# EAGLE schematic gamecontroller_Arduino_1.3 (EAGLE 9.3.0)
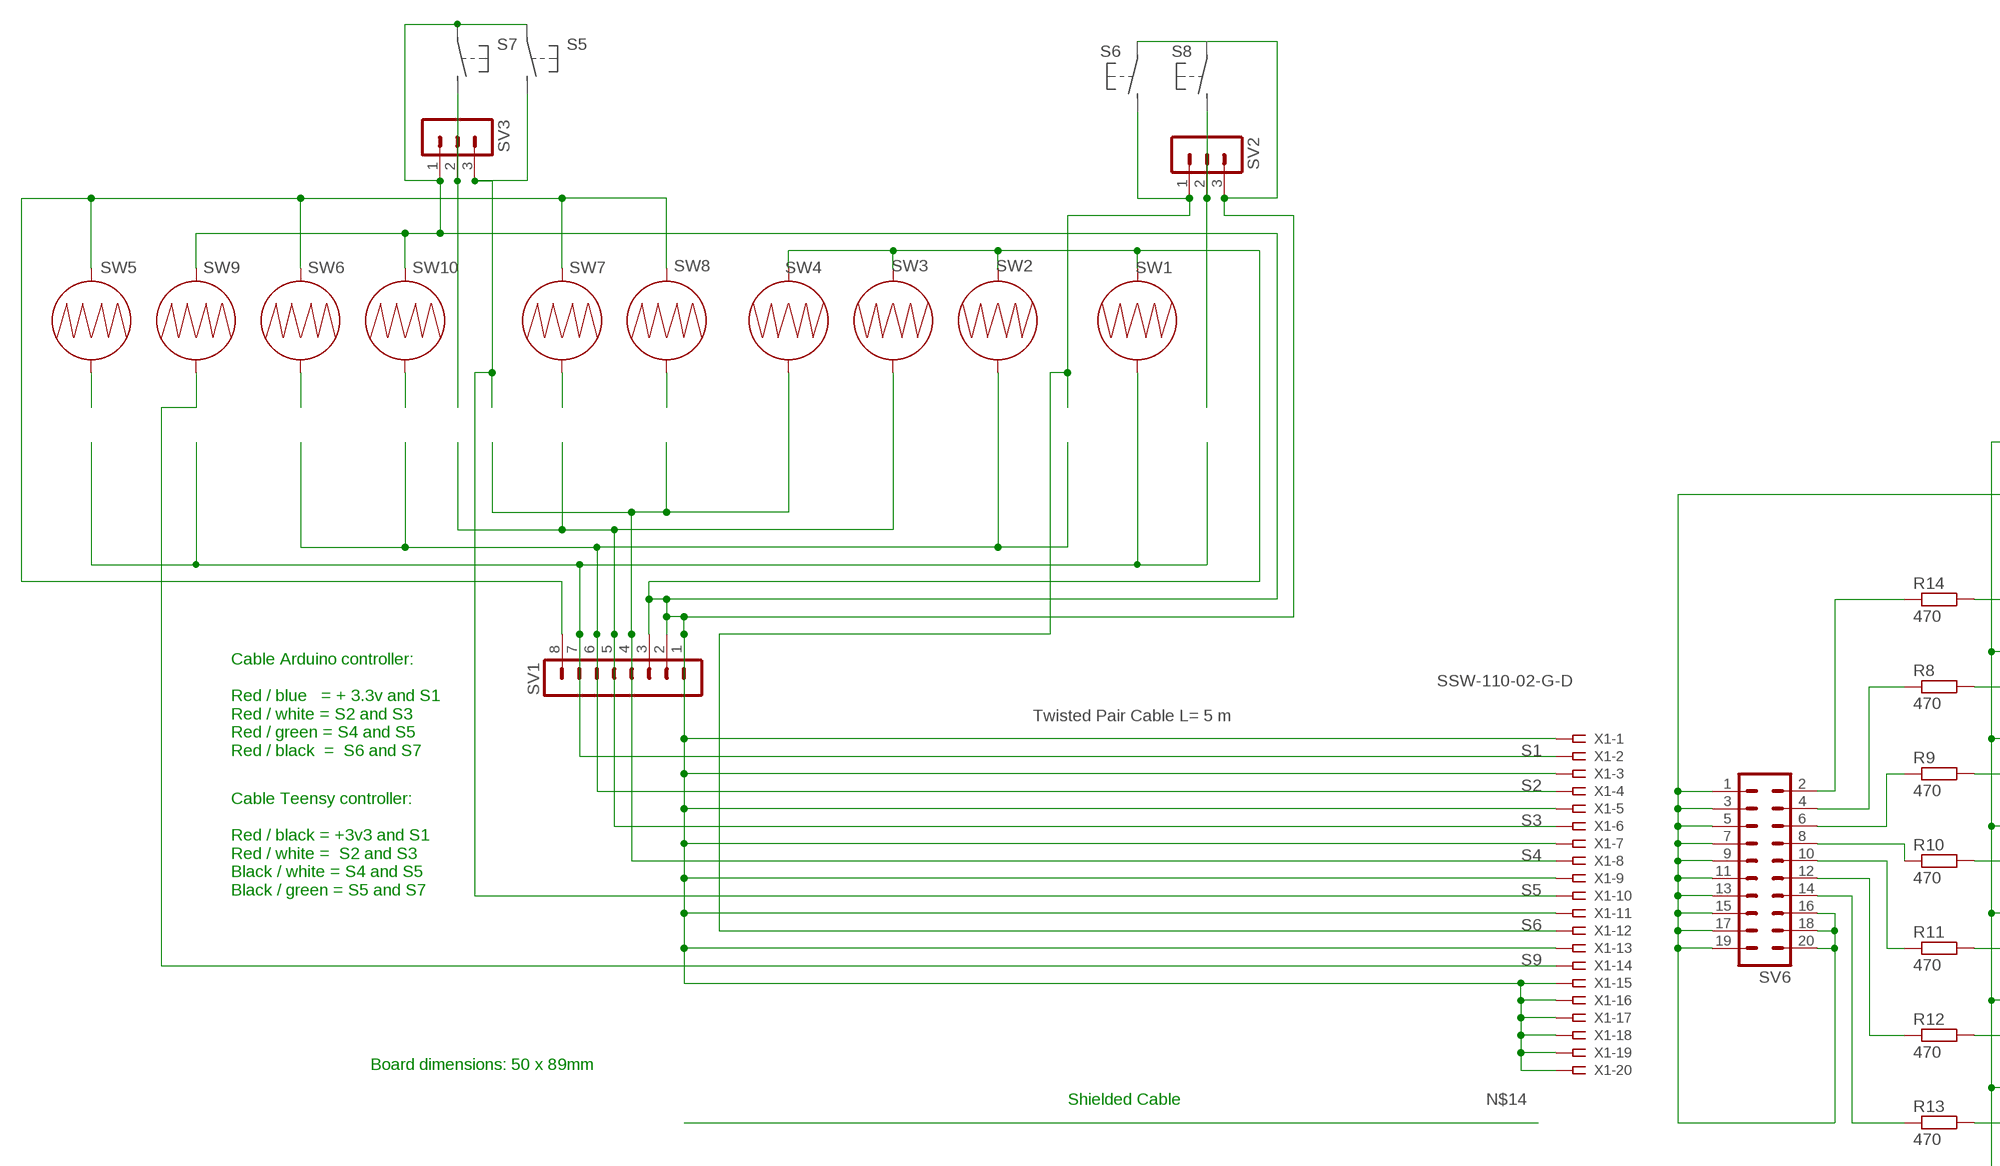
[diagram p0: schematic, sheet 1, part 1 of 2]
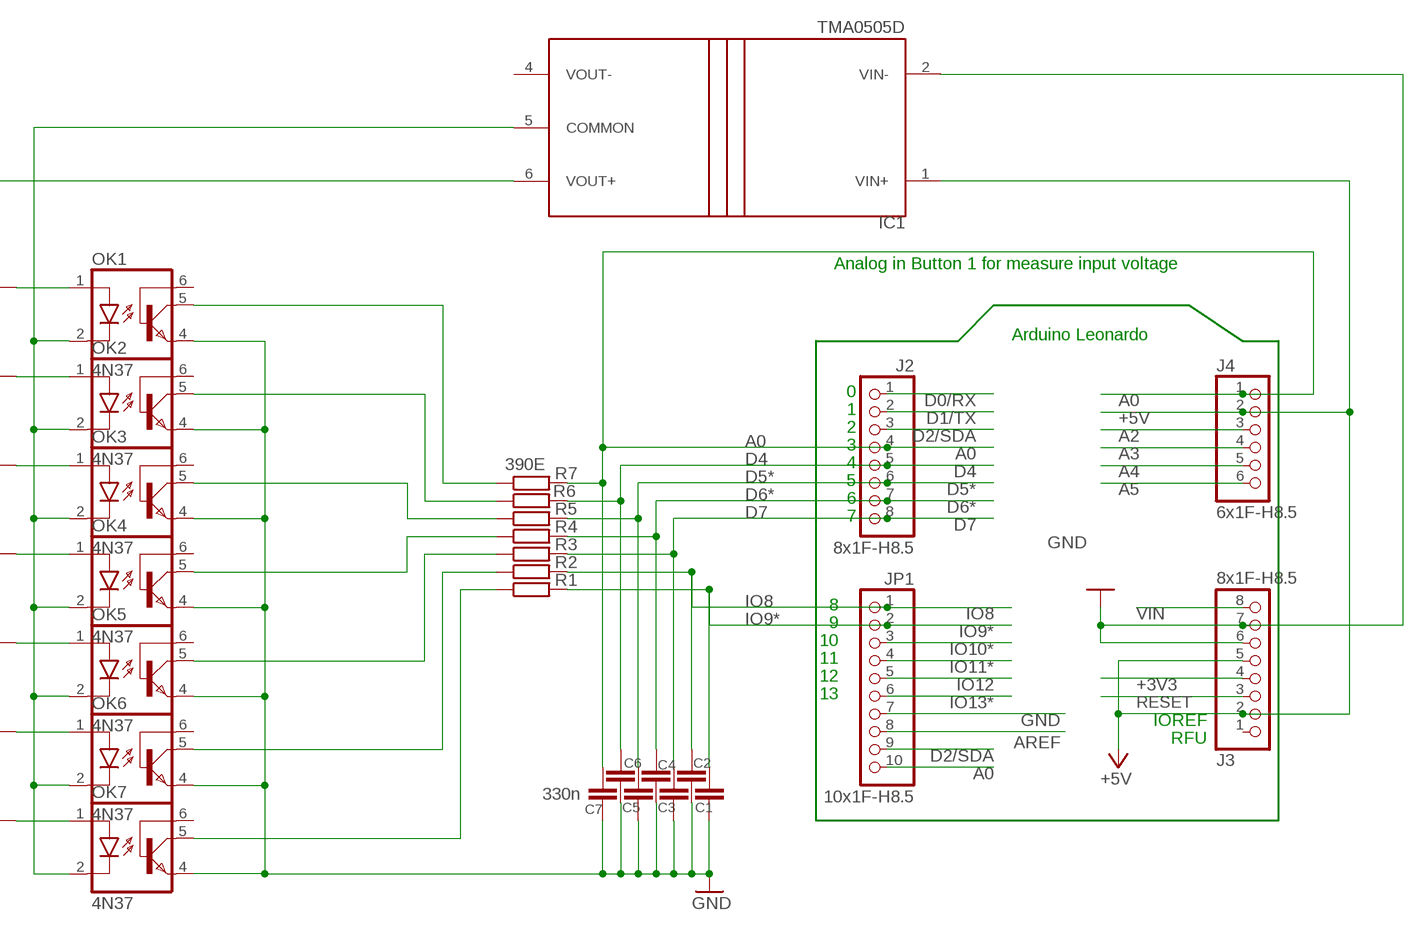
[diagram p1: schematic, sheet 1, part 2 of 2]

## Parts
C1  C-EU025-025X050  [C025-025X050]
C2  C-EU025-025X050  [C025-025X050]
C3  C-EU025-025X050  [C025-025X050]
C4  C-EU025-025X050  [C025-025X050]
C5  C-EU025-025X050  [C025-025X050]
C6  C-EU025-025X050  [C025-025X050]
C7  330n  C-EU025-025X050  [C025-025X050]
IC1  TMA0505D  [SIP7]
J2  8x1F-H8.5  PINHD-1X8  [1X08]
J3  8x1F-H8.5  PINHD-1X8  [1X08]
J4  6x1F-H8.5  PINHD-1X6  [1X06]
JP1  10x1F-H8.5  PINHD-1X10  [1X10]
OK1  4N37  [DIL06]
OK2  4N37  [DIL06]
OK3  4N37  [DIL06]
OK4  4N37  [DIL06]
OK5  4N37  [DIL06]
OK6  4N37  [DIL06]
OK7  4N37  [DIL06]
R1  R-EU_0204/5  [0204/5]
R2  R-EU_0204/5  [0204/5]
R3  R-EU_0204/5  [0204/5]
R4  R-EU_0204/5  [0204/5]
R5  R-EU_0204/5  [0204/5]
R6  R-EU_0204/5  [0204/5]
R7  390E  R-EU_0204/5  [0204/5]
R8  470  R-EU_0204/5  [0204/5]
R9  470  R-EU_0204/5  [0204/5]
R10  470  R-EU_0204/5  [0204/5]
R11  470  R-EU_0204/5  [0204/5]
R12  470  R-EU_0204/5  [0204/5]
R13  470  R-EU_0204/5  [0204/5]
R14  470  R-EU_0204/5  [0204/5]
SV1  MA08-1  [MA08-1]
SV2  MA03-1  [MA03-1]
SV3  MA03-1  [MA03-1]
SV6  MA10-2W  [MA10-2W]
SW1  BUTTON-CONDUCTIVESMD-0.1"  [BUTTON-CONDUCTIVE-0.1]
SW2  BUTTON-CONDUCTIVESMD-0.1"  [BUTTON-CONDUCTIVE-0.1]
SW3  BUTTON-CONDUCTIVESMD-0.1"  [BUTTON-CONDUCTIVE-0.1]
SW4  BUTTON-CONDUCTIVESMD-0.1"  [BUTTON-CONDUCTIVE-0.1]
SW5  BUTTON-CONDUCTIVESMD-0.1"  [BUTTON-CONDUCTIVE-0.1]
SW6  BUTTON-CONDUCTIVESMD-0.1"  [BUTTON-CONDUCTIVE-0.1]
SW7  BUTTON-CONDUCTIVESMD-0.1"  [BUTTON-CONDUCTIVE-0.1]
SW8  BUTTON-CONDUCTIVESMD-0.1"  [BUTTON-CONDUCTIVE-0.1]
SW9  BUTTON-CONDUCTIVESMD-0.1"  [BUTTON-CONDUCTIVE-0.1]
SW10  BUTTON-CONDUCTIVESMD-0.1"  [BUTTON-CONDUCTIVE-0.1]
X1  SSW-110-02-G-D  [SSW-110-02-G-D]

## Nets
+3V3: J3.4
+5V [usbvcc]: IC1.1(VIN+) J3.2 J3.5 J4.2
A0: C7.1 J2.4 J4.1 JP1.10 R7.2
A2: J4.3
A3: J4.4
A4: J4.5
A5: J4.6
AREF [aref]: JP1.8
COMMON: SV1.1 SV1.2 SV1.3 SV2.3 SV3.1 SW1.2 SW2.2 SW3.2 SW4.2 SW9.1 SW10.1 X1.1 X1.3 X1.5 X1.7 X1.9 X1.11 X1.13 X1.15 X1.16 X1.17 X1.18 X1.19 X1.20
D0/RX: J2.1
D1/TX: J2.2
D2/SDA: J2.3 JP1.9
D4: C6.1 J2.5 R6.2
D5*: C5.1 J2.6 R5.2
D6*: C4.1 J2.7 R4.2
D7: C3.1 J2.8 R3.2
GND: C1.2 C2.2 C3.2 C4.2 C5.2 C6.2 C7.2 IC1.2(VIN-) J3.6 J3.7 JP1.7 OK1.4(EMI) OK2.4(EMI) OK3.4(EMI) OK4.4(EMI) OK5.4(EMI) OK6.4(EMI) OK7.4(EMI)
IO8: C2.1 JP1.1 R2.2
IO9*: C1.1 JP1.2 R1.2
IO10*: JP1.3
IO11*: JP1.4
IO12: JP1.5
IO13*: JP1.6
N$1: R8.1 SV6.4
N$2: SV3.2
N$3: OK1.1(A) R14.2
N$4: SV1.8 SW5.1 SW6.1 SW7.1 SW8.1
N$5: SW10.2
N$6: R14.1 SV6.2
N$7: IC1.6(VOUT+) SV6.1 SV6.3 SV6.5 SV6.7 SV6.9 SV6.11 SV6.13 SV6.15 SV6.16 SV6.17 SV6.18 SV6.19 SV6.20
N$8: OK1.5(COL) R7.1
N$9: SW6.2
N$10: R9.1 SV6.6
N$11: SW8.2
N$12: SW5.2
N$13: R10.1 SV6.8
N$15: R11.1 SV6.10
N$16: SW7.2
N$17: R12.1 SV6.12
N$18: OK2.5(COL) R6.1
N$19: SV2.2
N$20: OK3.5(COL) R5.1
N$21: OK4.5(COL) R4.1
N$22: OK5.5(COL) R3.1
N$23: OK6.5(COL) R2.1
N$24: OK7.5(COL) R1.1
N$25: OK2.1(A) R8.2
N$26: OK3.1(A) R9.2
N$27: OK4.1(A) R10.2
N$29: R13.1 SV6.14
N$30: OK7.1(A) R13.2
N$31: OK6.1(A) R12.2
N$32: OK5.1(A) R11.2
N$35: IC1.5(COMMON) OK1.2(C) OK2.2(C) OK3.2(C) OK4.2(C) OK5.2(C) OK6.2(C) OK7.2(C)
RESET: J3.3
S1: SV1.7 SW1.1 X1.2
S2: SV1.6 SW2.1 X1.4
S3: SV1.5 SW3.1 X1.6
S4: SV1.4 SW4.1 X1.8
S5: SV3.3 X1.10
S6: SV2.1 X1.12
S9: SW9.2 X1.14
VIN [power]: J3.8
Unconnected: J3.1 OK1.6(BAS) OK2.6(BAS) OK3.6(BAS) OK4.6(BAS) OK5.6(BAS) OK6.6(BAS) OK7.6(BAS)

## Notes on the sheet
- Analog in Button 1 for measure input voltage
- Arduino Leonardo
- 0
- 1
- Twisted Pair Cable L= 5 m
- 2
- 3
- Cable Arduino controller:
  
  Red / blue   = + 3.3v and S1
  Red / white = S2 and S3
  Red / green = S4 and S5
  Red / black  =  S6 and S7
- 4
- 5
- 6
- 7
- Cable Teensy controller:
  
  Red / black = +3v3 and S1
  Red / white =  S2 and S3
  Black / white = S4 and S5
  Black / green = S5 and S7
- 8
- 9
- 10
- 11
- 12
- 13
- IOREF
- RFU
- Board dimensions: 50 x 89mm
- Shielded Cable

## Power pins joined to a net without a drawn wire
VOUT-: IC1.4(VOUT-)

## Library data of the parts
C1-C7 = rcl:C-EU: CAPACITOR, European symbol; SPICEPREFIX: C
IC1 = traco_tma:TMA: Traco Power TMA Series DC/DC Converter
J2 J3 = SmartPrj:PINHD-1X8: PIN HEADER
J4 = SmartPrj:PINHD-1X6: PIN HEADER
JP1 = SmartPrj:PINHD-1X10: PIN HEADER
OK1-OK7 = optocoupler:4N37: OPTO COUPLER Source: http://www.fairchildsemi.com/pf/4N/4N35-M.html; MF: FAIRCHILD SEMICONDUCTOR; MPN: 4N37; OC_FARNELL: 1612456; OC_NEWARK: 72K9948
R1-R14 = rcl:R-EU_: RESISTOR, European symbol; SPICEPREFIX: R
SV1 = con-lstb:MA08-1: PIN HEADER; OC_FARNELL: unknown; OC_NEWARK: unknown
SV2 SV3 = con-lstb:MA03-1: PIN HEADER; OC_FARNELL: unknown; OC_NEWARK: unknown
SV6 = con-lstb:MA10-2W: PIN HEADER; OC_FARNELL: unknown; OC_NEWARK: unknown
SW1-SW10 = tglib2:BUTTON-CONDUCTIVE: Conductive Button Used with rubber key pads. This one was designed and proven to work with the PolyCase Key FOB enclosures.
X1 = con-samtec:SSW-110-02-G: THROUGH-HOLE .025" SQ POST SOCKET Source: Samtec SSW.pdf; MF: Samtec Inc.; MPN: SSW-110-02-G-D; OC_FARNELL: unknown; OC_NEWARK: 11P9480

## Net classes
0 default: width 0.254 mm, drill 0.61 mm, clearance 0.254 mm
1 power: width 0.254 mm, drill 0.61 mm, clearance 0.254 mm
2 gnd: width 0.254 mm, drill 0.61 mm, clearance 0.254 mm
3 usbvcc: width 0.254 mm, drill 0.61 mm, clearance 0.254 mm
4 aref: width 0.254 mm, drill 0.61 mm, clearance 0.254 mm